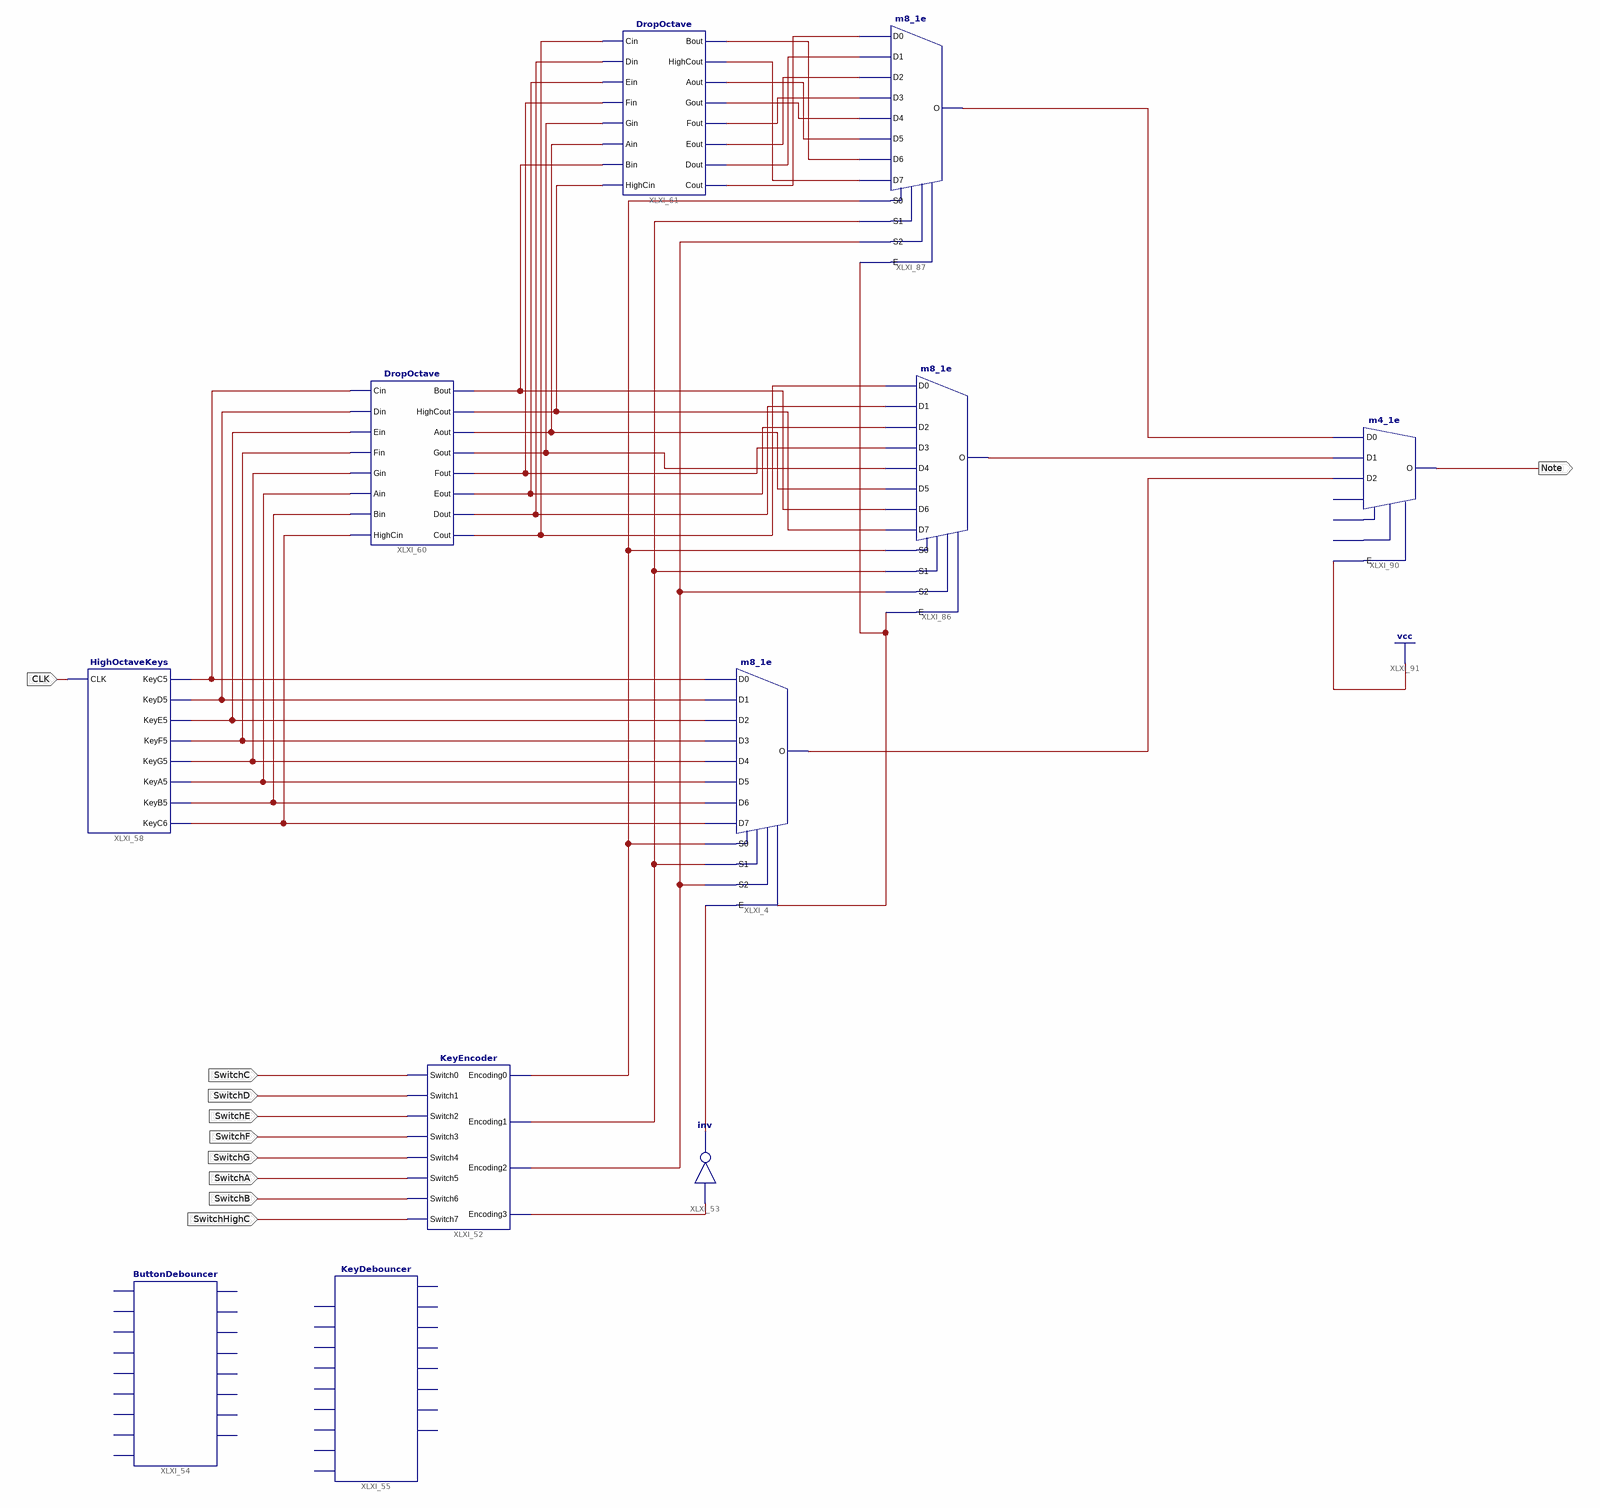
[diagram p0: schematic sheet 1]
// Xilinx ISE schematic PortableKeyboard.sch (spartan6) as structural Verilog: 11 symbols, 10 ports
module PortableKeyboard (
  input  CLK,
  input  SwitchHighC,
  input  SwitchB,
  input  SwitchA,
  input  SwitchG,
  input  SwitchF,
  input  SwitchE,
  input  SwitchD,
  input  SwitchC,
  output Note
);

  wire XLXN_90, XLXN_91, XLXN_247, XLXN_248, XLXN_249, XLXN_250, XLXN_251, XLXN_252, XLXN_253, XLXN_254,
       XLXN_255, XLXN_256, XLXN_257, XLXN_258, XLXN_260, XLXN_261, XLXN_262, XLXN_273, XLXN_278, XLXN_279,
       XLXN_280, XLXN_281, XLXN_282, XLXN_283, XLXN_284, XLXN_285, XLXN_299, XLXN_301, XLXN_303, XLXN_304,
       XLXN_305, XLXN_306, XLXN_307;

  m8_1e XLXI_4 (
    .D0(XLXN_247), .D1(XLXN_248), .D2(XLXN_249), .D3(XLXN_250), .D4(XLXN_251), .D5(XLXN_252), .D6(XLXN_253),
    .D7(XLXN_254), .E(XLXN_91), .S0(XLXN_299), .S1(XLXN_301), .S2(XLXN_303), .O(XLXN_307));
  HighOctaveKeys XLXI_58 (
    .CLK(CLK), .KeyC5(XLXN_247), .KeyD5(XLXN_248), .KeyE5(XLXN_249), .KeyF5(XLXN_250), .KeyG5(XLXN_251),
    .KeyA5(XLXN_252), .KeyB5(XLXN_253), .KeyC6(XLXN_254));
  KeyDebouncer XLXI_55 ();  // open: Switch1, Switch2, Switch3, Switch4, Switch5, Switch6, Switch7, Switch8, SwitchOut8, SwitchOut7, SwitchOut6, SwitchOut5, SwitchOut4, SwitchOut3, SwitchOut2, SwitchOut1, CLK
  ButtonDebouncer XLXI_54 ();  // open: CLK, Button1, Button4, Button3, Button2, Button5, Button8, Button7, Button6, ButtonOut1, ButtonOut4, ButtonOut3, ButtonOut2, ButtonOut5, ButtonOut8, ButtonOut7, ButtonOut6
  DropOctave XLXI_60 (
    .Cin(XLXN_247), .Din(XLXN_248), .Ein(XLXN_249), .Fin(XLXN_250), .Gin(XLXN_251), .Ain(XLXN_252),
    .Bin(XLXN_253), .HighCin(XLXN_254), .Bout(XLXN_262), .HighCout(XLXN_261), .Aout(XLXN_260),
    .Gout(XLXN_273), .Fout(XLXN_258), .Eout(XLXN_257), .Dout(XLXN_256), .Cout(XLXN_255));
  DropOctave XLXI_61 (
    .Cin(XLXN_255), .Din(XLXN_256), .Ein(XLXN_257), .Fin(XLXN_258), .Gin(XLXN_273), .Ain(XLXN_260),
    .Bin(XLXN_262), .HighCin(XLXN_261), .Bout(XLXN_284), .HighCout(XLXN_285), .Aout(XLXN_283),
    .Gout(XLXN_282), .Fout(XLXN_281), .Eout(XLXN_280), .Dout(XLXN_279), .Cout(XLXN_278));
  m8_1e XLXI_86 (
    .D0(XLXN_255), .D1(XLXN_256), .D2(XLXN_257), .D3(XLXN_258), .D4(XLXN_273), .D5(XLXN_260), .D6(XLXN_262),
    .D7(XLXN_261), .E(XLXN_304), .S0(XLXN_299), .S1(XLXN_301), .S2(XLXN_303), .O(XLXN_306));
  m8_1e XLXI_87 (
    .D0(XLXN_278), .D1(XLXN_279), .D2(XLXN_280), .D3(XLXN_281), .D4(XLXN_282), .D5(XLXN_283), .D6(XLXN_284),
    .D7(XLXN_285), .E(XLXN_304), .S0(XLXN_299), .S1(XLXN_301), .S2(XLXN_303), .O(XLXN_305));
  not XLXI_53 (XLXN_91, XLXN_90);
  KeyEncoder XLXI_52 (
    .Switch0(SwitchC), .Switch1(SwitchD), .Switch2(SwitchE), .Switch3(SwitchF), .Switch4(SwitchG),
    .Switch5(SwitchA), .Switch6(SwitchB), .Switch7(SwitchHighC), .Encoding0(XLXN_299), .Encoding1(XLXN_301),
    .Encoding2(XLXN_303), .Encoding3(XLXN_90));
  m4_1e XLXI_90 (.D0(XLXN_305), .D1(XLXN_306), .D2(XLXN_307), .E(1'b1), .O(Note));  // open: D3, S0, S1

  // Notes on the sheet:
  //   LOC on signal CLK = V10
  //   LOC on signal SwitchHighC = T10
  //   LOC on signal SwitchB = T9
  //   LOC on signal SwitchA = V9
  //   LOC on signal SwitchG = M8
  //   LOC on signal SwitchF = N8
  //   LOC on signal SwitchE = U8
  //   LOC on signal SwitchD = V8
  //   LOC on signal SwitchC = T5
  //   LOC on signal Note = T12
endmodule
